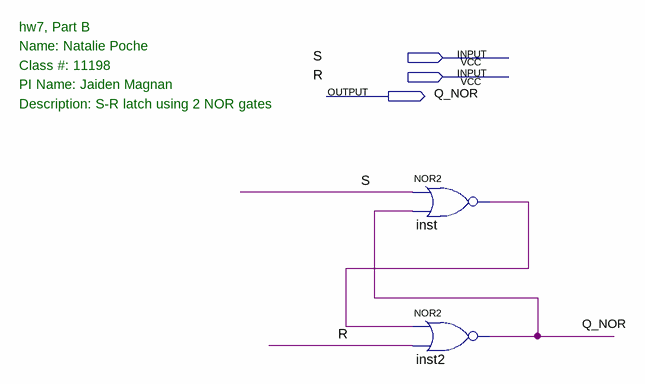
[diagram p0: schematic sheet]
// Quartus schematic SR_NOR.bdf as structural Verilog: 2 symbols, 3 pins
module SR_NOR (
  input  S,
  input  R,
  output Q_NOR
);

  wire inst_out;

  nor inst (inst_out, S, Q_NOR);
  nor inst2 (Q_NOR, inst_out, R);

  // Notes on the sheet:
  //   hw7, Part B
  //   Name: Natalie Poche
  //   Class #: 11198
  //   PI Name: Jaiden Magnan
  //   Description: S-R latch using 2 NOR gates
endmodule
